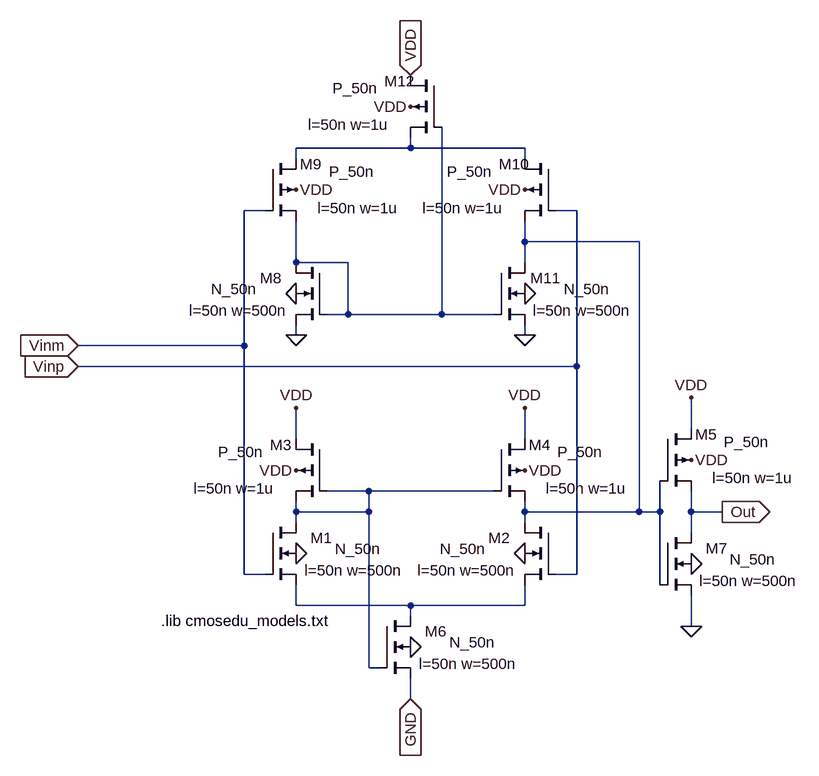
[diagram p0: schematic Fig_18_23.asc]
Fig_18_23.asc, the LTspice schematic file:
Version 4
SHEET 1 1496 680
WIRE 512 -768 256 -768
WIRE 512 -768 512 -976
WIRE 512 -416 512 -768
WIRE 544 -976 512 -976
WIRE 544 -416 512 -416
WIRE 592 -1056 592 -1072
WIRE 592 -896 592 -960
WIRE 592 -784 592 -800
WIRE 592 -624 592 -672
WIRE 592 -512 592 -528
WIRE 592 -496 592 -512
WIRE 592 -368 592 -400
WIRE 672 -896 592 -896
WIRE 672 -816 640 -816
WIRE 672 -816 672 -896
WIRE 704 -544 640 -544
WIRE 704 -512 592 -512
WIRE 704 -512 704 -544
WIRE 704 -272 704 -512
WIRE 720 -272 704 -272
WIRE 768 -1072 592 -1072
WIRE 768 -1072 768 -1088
WIRE 768 -368 592 -368
WIRE 768 -352 768 -368
WIRE 768 -224 768 -256
WIRE 816 -816 672 -816
WIRE 816 -816 816 -1104
WIRE 896 -816 816 -816
WIRE 896 -544 704 -544
WIRE 944 -1072 768 -1072
WIRE 944 -1056 944 -1072
WIRE 944 -928 944 -960
WIRE 944 -896 944 -928
WIRE 944 -784 944 -800
WIRE 944 -624 944 -672
WIRE 944 -512 944 -528
WIRE 944 -496 944 -512
WIRE 944 -368 768 -368
WIRE 944 -368 944 -400
WIRE 1024 -976 992 -976
WIRE 1024 -736 256 -736
WIRE 1024 -736 1024 -976
WIRE 1024 -416 992 -416
WIRE 1024 -416 1024 -736
WIRE 1120 -928 944 -928
WIRE 1120 -512 944 -512
WIRE 1120 -512 1120 -928
WIRE 1152 -512 1120 -512
WIRE 1152 -512 1152 -560
WIRE 1152 -400 1152 -512
WIRE 1200 -640 1200 -688
WIRE 1200 -512 1200 -544
WIRE 1200 -480 1200 -512
WIRE 1200 -336 1200 -384
WIRE 1248 -512 1200 -512
FLAG 592 -448 0
FLAG 592 -576 VDD
FLAG 592 -672 VDD
FLAG 944 -576 VDD
FLAG 944 -448 0
FLAG 944 -672 VDD
FLAG 768 -304 0
FLAG 1200 -592 VDD
FLAG 1200 -688 VDD
FLAG 1200 -432 0
FLAG 1200 -336 0
FLAG 592 -848 0
FLAG 592 -1008 VDD
FLAG 944 -1008 VDD
FLAG 944 -848 0
FLAG 768 -1136 VDD
FLAG 592 -784 0
FLAG 944 -784 0
FLAG 768 -1184 VDD
IOPIN 768 -1184 In
FLAG 768 -224 GND
IOPIN 768 -224 In
FLAG 1248 -512 Out
IOPIN 1248 -512 Out
FLAG 256 -768 Vinm
IOPIN 256 -768 In
FLAG 256 -736 Vinp
IOPIN 256 -736 In
SYMBOL nmos4 544 -496 R0
WINDOW 0 104 24 Right 0
WINDOW 3 179 41 Right 0
WINDOW 123 213 74 Right 0
SYMATTR InstName M1
SYMATTR Value N_50n
SYMATTR Value2 l=50n w=500n
SYMBOL pmos4 640 -624 M0
WINDOW 0 88 9 Right 0
WINDOW 3 168 20 Right 0
WINDOW 123 206 76 Right 0
SYMATTR InstName M3
SYMATTR Value P_50n
SYMATTR Value2 l=50n w=1u
SYMBOL pmos4 896 -624 R0
WINDOW 0 88 9 Right 0
WINDOW 3 168 20 Right 0
WINDOW 123 206 76 Right 0
SYMATTR InstName M4
SYMATTR Value P_50n
SYMATTR Value2 l=50n w=1u
SYMBOL nmos4 992 -496 M0
WINDOW 0 104 24 Right 0
WINDOW 3 179 41 Right 0
WINDOW 123 213 74 Right 0
SYMATTR InstName M2
SYMATTR Value N_50n
SYMATTR Value2 l=50n w=500n
SYMBOL nmos4 720 -352 R0
WINDOW 0 104 24 Right 0
WINDOW 3 179 41 Right 0
WINDOW 123 213 74 Right 0
SYMATTR InstName M6
SYMATTR Value N_50n
SYMATTR Value2 l=50n w=500n
SYMBOL pmos4 1152 -640 R0
WINDOW 0 88 9 Right 0
WINDOW 3 168 20 Right 0
WINDOW 123 206 76 Right 0
SYMATTR InstName M5
SYMATTR Value P_50n
SYMATTR Value2 l=50n w=1u
SYMBOL nmos4 1152 -480 R0
WINDOW 0 104 24 Right 0
WINDOW 3 179 41 Right 0
WINDOW 123 213 74 Right 0
SYMATTR InstName M7
SYMATTR Value N_50n
SYMATTR Value2 l=50n w=500n
SYMBOL nmos4 640 -896 M0
WINDOW 0 104 24 Right 0
WINDOW 3 179 41 Right 0
WINDOW 123 213 74 Right 0
SYMATTR InstName M8
SYMATTR Value N_50n
SYMATTR Value2 l=50n w=500n
SYMBOL pmos4 544 -1056 R0
WINDOW 0 88 9 Right 0
WINDOW 3 168 20 Right 0
WINDOW 123 206 76 Right 0
SYMATTR InstName M9
SYMATTR Value P_50n
SYMATTR Value2 l=50n w=1u
SYMBOL pmos4 992 -1056 M0
WINDOW 0 88 9 Right 0
WINDOW 3 168 20 Right 0
WINDOW 123 206 76 Right 0
SYMATTR InstName M10
SYMATTR Value P_50n
SYMATTR Value2 l=50n w=1u
SYMBOL nmos4 896 -896 R0
WINDOW 0 104 24 Right 0
WINDOW 3 179 41 Right 0
WINDOW 123 213 74 Right 0
SYMATTR InstName M11
SYMATTR Value N_50n
SYMATTR Value2 l=50n w=500n
SYMBOL pmos4 816 -1184 M0
WINDOW 0 88 9 Right 0
WINDOW 3 168 20 Right 0
WINDOW 123 206 76 Right 0
SYMATTR InstName M12
SYMATTR Value P_50n
SYMATTR Value2 l=50n w=1u
TEXT 384 -344 Left 0 !.lib cmosedu_models.txt

The netlist it stands for:
* Fig_18_23.asc
M1 N003 Vinm N004 0 N_50n l=50n w=500n
M3 VDD N003 N003 VDD P_50n l=50n w=1u
M4 VDD N003 N005 VDD P_50n l=50n w=1u
M2 N005 Vinp N004 0 N_50n l=50n w=500n
M6 N004 N003 GND 0 N_50n l=50n w=500n
M5 VDD N005 Out VDD P_50n l=50n w=1u
M7 Out N005 0 0 N_50n l=50n w=500n
M8 N002 N002 0 0 N_50n l=50n w=500n
M9 N001 Vinm N002 VDD P_50n l=50n w=1u
M10 N001 Vinp N005 VDD P_50n l=50n w=1u
M11 N005 N002 0 0 N_50n l=50n w=500n
M12 VDD N002 N001 VDD P_50n l=50n w=1u
.model NMOS NMOS
.model PMOS PMOS
.lib standard.mos
.lib cmosedu_models.txt
.backanno
.end